# EAGLE design input_switch2 (EAGLE 6.5.0)
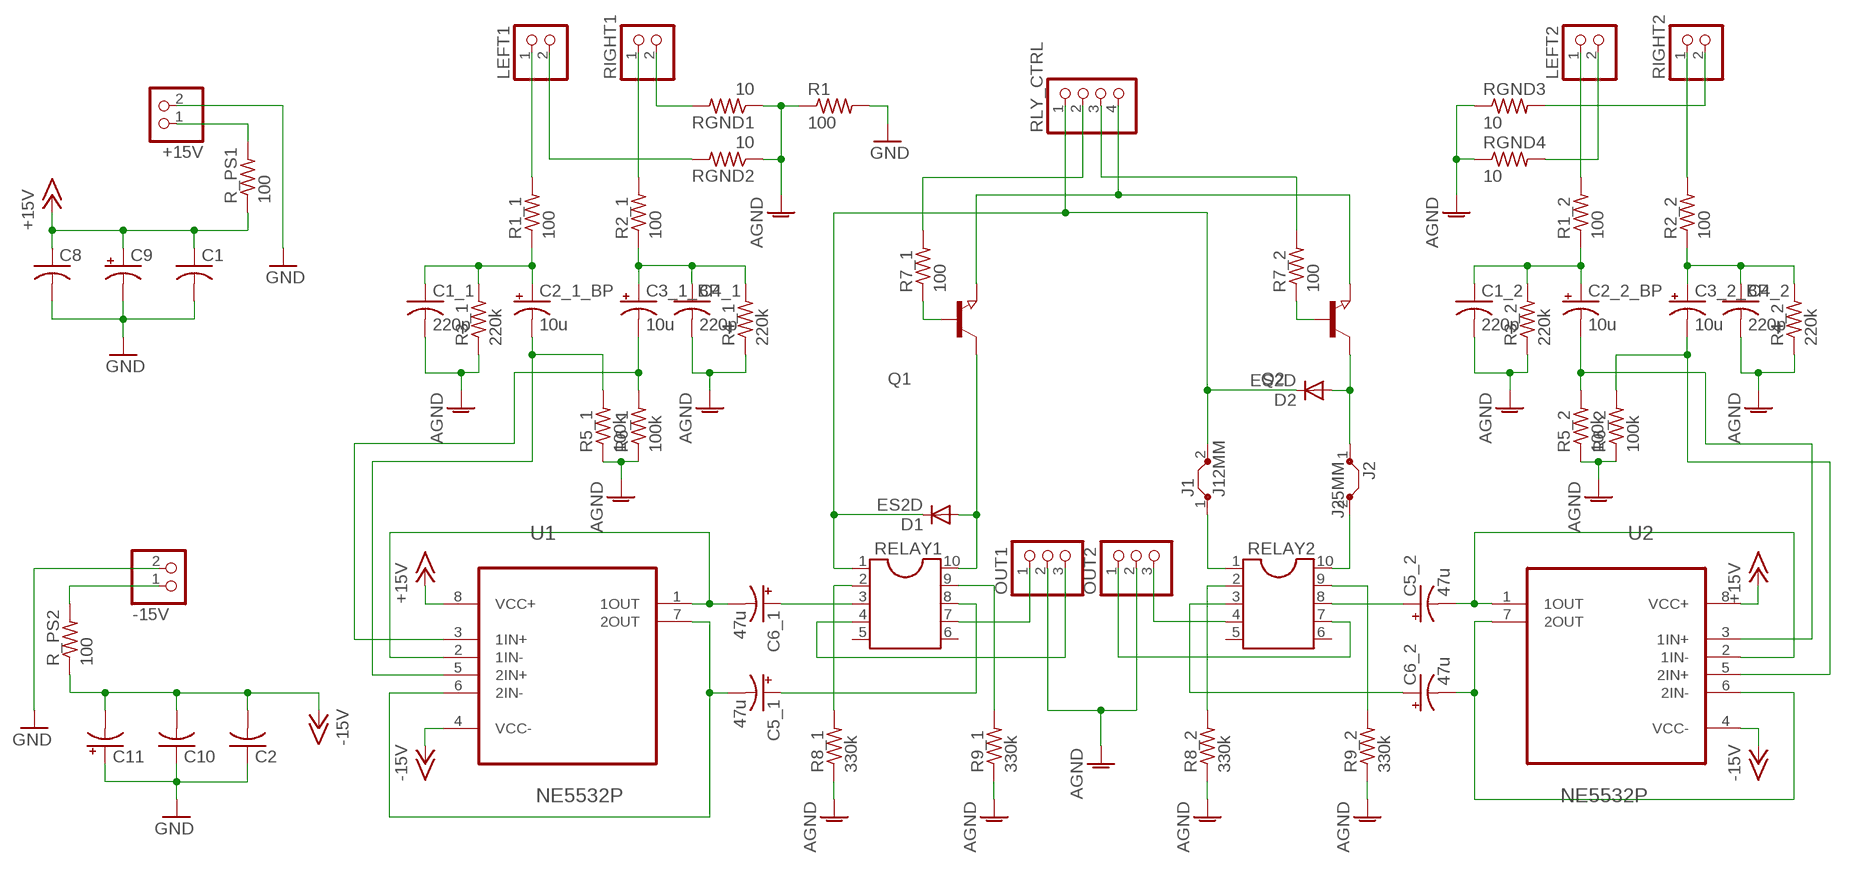
[diagram p0: schematic, sheet 1]

## Parts
+15V  PINHD-1X2  [1X02]
-15V  PINHD-1X2  [1X02]
C1  C-USC1206  [C1206]
C1_1  220p  C-US025-024X044  [C025-024X044]
C1_2  220p  C-US025-024X044  [C025-024X044]
C2  C-USC1206  [C1206]
C2_1_BP  10u  CPOL-USE2.5-7  [E2,5-7]
C2_2_BP  10u  CPOL-USE2.5-7  [E2,5-7]
C3_1_BP  10u  CPOL-USE2.5-7  [E2,5-7]
C3_2_BP  10u  CPOL-USE2.5-7  [E2,5-7]
C4_1  220p  C-US025-024X044  [C025-024X044]
C4_2  220p  C-US025-024X044  [C025-024X044]
C5_1  47u  CPOL-USE2-5  [E2-5]
C5_2  47u  CPOL-USE2-5  [E2-5]
C6_1  47u  CPOL-USE2-5  [E2-5]
C6_2  47u  CPOL-USE2-5  [E2-5]
C8  C-USC1206  [C1206]
C9  CPOL-USE2-5  [E2-5]
C10  C-USC1206  [C1206]
C11  CPOL-USE2-5  [E2-5]
D1  ES2D  [SMB]
D2  ES2D  [SMB]
J1  J12MM  [12]
J2  J25MM  [25]
LEFT1  PINHD-1X2  [1X02]
LEFT2  PINHD-1X2  [1X02]
OUT1  PINHD-1X3  [1X03]
OUT2  PINHD-1X3  [1X03]
Q1  NPN-TRANSISTOR_SOT23  [SOT23]
Q2  NPN-TRANSISTOR_SOT23  [SOT23]
R1  100  R-US_R1206  [R1206]
R1_1  100  R-US_0207/7  [0207/7]
R1_2  100  R-US_0207/7  [0207/7]
R2_1  100  R-US_0207/7  [0207/7]
R2_2  100  R-US_0207/7  [0207/7]
R3_1  220k  R-US_0207/7  [0207/7]
R3_2  220k  R-US_0207/7  [0207/7]
R4_1  220k  R-US_0207/7  [0207/7]
R4_2  220k  R-US_0207/7  [0207/7]
R5_1  100k  R-US_0207/7  [0207/7]
R5_2  100k  R-US_0207/7  [0207/7]
R6_1  100k  R-US_0207/7  [0207/7]
R6_2  100k  R-US_0207/7  [0207/7]
R7_1  100  R-US_R1206  [R1206]
R7_2  100  R-US_R1206  [R1206]
R8_1  330k  R-US_R1206  [R1206]
R8_2  330k  R-US_R1206  [R1206]
R9_1  330k  R-US_R1206  [R1206]
R9_2  330k  R-US_R1206  [R1206]
R_PS1  100  R-US_0207/7  [0207/7]
R_PS2  100  R-US_0207/7  [0207/7]
RELAY1  DIL10  [DIL10]
RELAY2  DIL10  [DIL10]
RGND1  10  R-US_R1206  [R1206]
RGND2  10  R-US_R1206  [R1206]
RGND3  10  R-US_R1206  [R1206]
RGND4  10  R-US_R1206  [R1206]
RIGHT1  PINHD-1X2  [1X02]
RIGHT2  PINHD-1X2  [1X02]
RLY_CTRL  PINHD-1X4  [1X04]
U1  NE5532P  [DIP254P762X508-8]
U2  NE5532P  [DIP254P762X508-8]

## Nets
+15V: C1.1 C8.1 C9.+ R_PS1.1 U1.8(VCC+) U2.8(VCC+)
-15V: C2.2 C10.2 C11.- R_PS2.1 U1.4(VCC-) U2.4(VCC-)
AGND: C1_1.2 C1_2.2 C4_1.2 C4_2.2 OUT1.2 OUT2.2 R1.1 R3_1.1 R3_2.1 R4_1.1 R4_2.1 R5_1.1 R5_2.1 R6_1.1 R6_2.1 R8_1.1 R8_2.1 R9_1.1 R9_2.1 RGND1.1 RGND2.1 RGND3.1 RGND4.1
GND: +15V.2 -15V.2 C1.2 C2.1 C8.2 C9.- C10.1 C11.+ R1.2
N$1: R2_1.2 RIGHT1.1
N$2: LEFT1.1 R1_1.2
N$3: C1_1.1 C2_1_BP.+ R1_1.1 R3_1.2
N$4: C2_1_BP.- R5_1.2 U1.5(2IN+)
N$5: C5_1.- U1.6(2IN-) U1.7(2OUT)
N$6: C3_1_BP.+ C4_1.1 R2_1.1 R4_1.2
N$7: C6_1.- U1.1(1OUT) U1.2(1IN-)
N$8: C6_1.+ RELAY1.3
N$9: OUT1.3 RELAY1.4
N$10: C6_2.- U2.6(2IN-) U2.7(2OUT)
N$11: R8_1.2 RELAY1.2
N$12: R9_1.2 RELAY1.9
N$13: C5_2.- U2.1(1OUT) U2.2(1IN-)
N$14: OUT1.1 RELAY1.7
N$15: R7_1.2 RLY_CTRL.2
N$16: Q1.1(B) R7_1.1
N$17: -15V.1 R_PS2.2
N$18: D1.A Q1.3(C) RELAY1.10
N$19: OUT2.1 RELAY2.7
N$20: C3_1_BP.- R6_1.2 U1.3(1IN+)
N$21: R2_2.2 RIGHT2.1
N$22: LEFT2.1 R1_2.2
N$23: C1_2.1 C2_2_BP.+ R1_2.1 R3_2.2
N$24: C3_2_BP.+ C4_2.1 R2_2.1 R4_2.2
N$25: +15V.1 R_PS1.2
N$26: C3_2_BP.- R6_2.2 U2.5(2IN+)
N$27: C2_2_BP.- R5_2.2 U2.3(1IN+)
N$28: OUT2.3 RELAY2.4
N$29: C6_2.+ RELAY2.3
N$30: C5_2.+ RELAY2.8
N$31: C5_1.+ RELAY1.8
N$32: R7_2.2 RLY_CTRL.3
N$33: LEFT1.2 RGND2.2
N$34: R8_2.2 RELAY2.2
N$35: R9_2.2 RELAY2.9
N$36: RGND1.2 RIGHT1.2
N$37: D1.C D2.C J1.2 RELAY1.1 RLY_CTRL.1
N$38: D2.A J2.1 Q2.3(C)
N$39: Q2.1(B) R7_2.1
N$40: Q1.2(E) Q2.2(E) RLY_CTRL.4
N$41: J1.1 RELAY2.1
N$42: RGND3.2 RIGHT2.2
N$43: LEFT2.2 RGND4.2
N$44: J2.2 RELAY2.10
Unconnected: RELAY1.5 RELAY1.6 RELAY2.5 RELAY2.6

## Library data of the parts
+15V -15V LEFT1 LEFT2 RIGHT1 RIGHT2 = pinhead:PINHD-1X2: PIN HEADER
C1 C1_1 C1_2 C2 C4_1 C4_2 C8 C10 = rcl:C-US: CAPACITOR, American symbol
C2_1_BP C2_2_BP C3_1_BP C3_2_BP C5_1 C5_2 C6_1 C6_2 C9 C11 = rcl:CPOL-US: POLARIZED CAPACITOR, American symbol
D1 D2 = diode:ES2D: DIODE super fast rectifier, 2 A
J1 J2 = jumper:J: Bridge
OUT1 OUT2 = pinhead:PINHD-1X3: PIN HEADER
Q1 Q2 = semicon-smd-ipc:NPN-TRANSISTOR_: NPN TRANSISTOR
R1 R1_1 R1_2 R2_1 R2_2 R3_1 R3_2 R4_1 R4_2 R5_1 R5_2 R6_1 R6_2 R7_1 R7_2 R8_1 R8_2 R9_1 R9_2 R_PS1 R_PS2 RGND1-RGND4 = rcl:R-US_: RESISTOR, American symbol
RELAY1 RELAY2 = ic-package:DIL10: Dual In Line / Socket
RLY_CTRL = pinhead:PINHD-1X4: PIN HEADER
U1 U2 = ne5532:NE5532P: OPERATIONAL AMPLIFIERS; MPN: NE5532P; OC_FARNELL: 1106092; OC_NEWARK: 59K8751; PACKAGE: PDIP; SUPPLIER: Texas Instruments

## Board
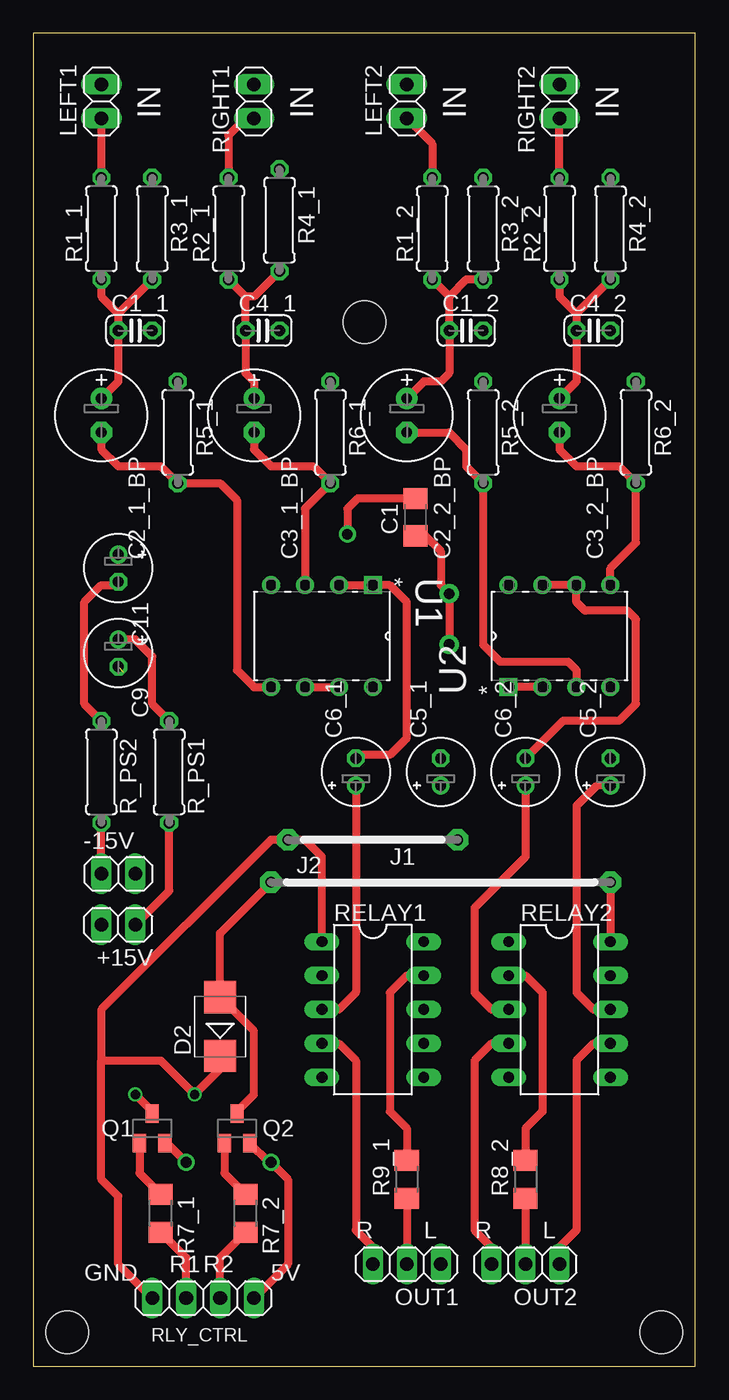
[diagram p1: board, top side]
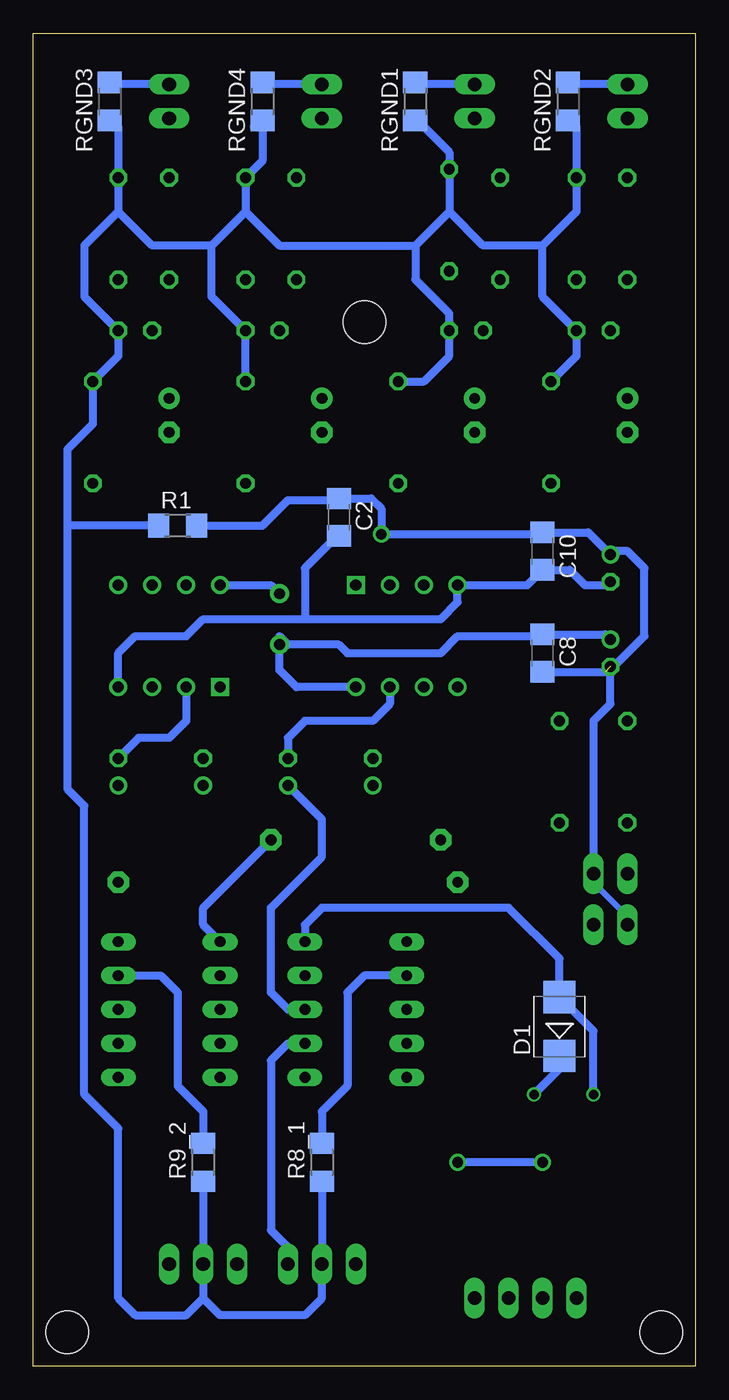
[diagram p2: board, bottom side, seen from below]

Size 49.53 x 99.69 mm. Coordinates in mm from the lower left corner, seen from the top.
Outline: 0,0 49.53,0 49.53,99.69 0,99.69 0,0
Copper layers (1*16): Top 0.035mm / dielectric 1.5mm / Bottom 0.035mm
Design rules "SeeedStudio_2layer_DRU_no_angle_20140221": minimum track width 6mil, minimum drill 12mil, track to track 6mil, track to pad 6mil, pad to pad 6mil, via to via 6mil, smd to smd 0mil, copper to edge 10mil, drill to drill 10mil, minimum pad ring 10mil, minimum via ring 6mil, stop-mask expansion 2mil, vias tented up to drill 100mil, thermal gap 10mil
Holes 3.2 mm at 46.99,2.54 2.54,2.54 24.77,78.11

### Footprints (pad centres in the part's own frame; a part is rotated, then mirrored left to right if it is on the bottom)
1X02 = drill 1.016 long: 1 -1.27,0; 2 1.27,0
C1206 = smd 1.6 x 1.8: 1 -1.4,0; 2 1.4,0
C025-024X044 = drill 0.813 octagon: 1 -1.27,0; 2 1.27,0
E2,5-7 = drill 0.813 pad 1.6: + -1.27,0 | drill 0.813 pad 1.6 octagon: - 1.27,0
E2-5 = drill 0.813 pad 1.27: + -1.016,0 | drill 0.813 pad 1.27 octagon: - 1.016,0
SMB = smd 2.4 x 2.4: A 2.2,0; C -2.2,0
12 = drill 0.813 pad 1.6 octagon: 1 -6.35,0; 2 6.35,0
25 = drill 0.813 pad 1.6 octagon: 1 -12.7,0; 2 12.7,0
1X03 = drill 1.016 long: 1 -2.54,0; 2 0,0; 3 2.54,0
SOT23 = smd 1 x 1.4: 1 -0.95,-1.1; 2 0.95,-1.1; 3 0,1.1
R1206 = smd 1.6 x 1.803: 1 -1.422,0; 2 1.422,0
0207/7 = drill 0.813 octagon: 1 -3.81,0; 2 3.81,0
DIL10 = drill 0.813 long: 1 -5.08,-3.81; 2 -2.54,-3.81; 3 0,-3.81; 4 2.54,-3.81; 5 5.08,-3.81; 6 5.08,3.81; 7 2.54,3.81; 8 0,3.81; 9 -2.54,3.81; 10 -5.08,3.81
1X04 = drill 1.016 long: 1 -3.81,0; 2 -1.27,0; 3 1.27,0; 4 3.81,0
DIP254P762X508-8 = drill 0.838 square: 1 -7.62,7.62 | drill 0.838: 2 -7.62,5.08; 3 -7.62,2.54; 4 -7.62,0; 5 0,0; 6 0,2.54; 7 0,5.08; 8 0,7.62

### Placement (x,y rotation side)
+15V  6.35,33.02 180 top
-15V  6.35,36.83 0 top
C1  28.57,63.5 90 top
C1_1  7.62,77.47 0 top
C1_2  32.38,77.47 0 top
C2  26.67,63.5 270 bottom
C2_1_BP  5.08,71.12 270 top
C2_2_BP  27.94,71.12 270 top
C3_1_BP  16.51,71.12 270 top
C3_2_BP  39.37,71.12 270 top
C4_1  17.14,77.47 0 top
C4_2  41.91,77.47 0 top
C5_1  30.48,44.45 90 top
C5_2  43.18,44.45 90 top
C6_1  24.13,44.45 90 top
C6_2  36.83,44.45 90 top
C8  11.43,53.34 270 bottom
C9  6.35,53.34 270 top
C10  11.43,60.96 270 bottom
C11  6.35,59.69 270 top
D1  10.16,25.4 90 bottom
D2  13.97,25.4 90 top
J1  25.4,39.37 180 top
J2  30.48,36.2 0 top
LEFT1  5.08,94.61 90 top
LEFT2  27.94,94.61 90 top
OUT1  27.94,7.62 180 top
OUT2  36.83,7.62 180 top
Q1  8.89,17.78 0 top
Q2  15.24,17.78 0 top
R1  38.73,62.87 0 bottom
R1_1  5.08,85.09 90 top
R1_2  29.84,85.09 90 top
R2_1  14.61,85.09 90 top
R2_2  39.37,85.09 90 top
R3_1  8.89,85.09 270 top
R3_2  33.66,85.09 270 top
R4_1  18.41,85.72 270 top
R4_2  43.18,85.09 270 top
R5_1  10.79,69.85 270 top
R5_2  33.66,69.85 270 top
R6_1  22.23,69.85 270 top
R6_2  45.09,69.85 270 top
R7_1  9.53,11.43 270 top
R7_2  15.88,11.43 270 top
R8_1  27.94,15.24 90 bottom
R8_2  36.83,13.97 90 top
R9_1  27.94,13.97 90 top
R9_2  36.83,15.24 90 bottom
R_PS1  10.16,44.45 270 top
R_PS2  5.08,44.45 270 top
RELAY1  25.4,26.67 270 top
RELAY2  39.37,26.67 270 top
RGND1  20.95,94.61 90 bottom
RGND2  9.53,94.61 90 bottom
RGND3  43.81,94.61 90 bottom
RGND4  32.38,94.61 90 bottom
RIGHT1  16.51,94.61 90 top
RIGHT2  39.37,94.61 90 top
RLY_CTRL  12.7,5.08 0 top
U1  17.78,50.8 270 top
U2  43.18,58.42 90 top

### Tracks (layer width: path | path; a pad name or v marks a point on that pad's centre or on a via)
+15V  (via drill 0.8 pad 1.42)
  Top 0.61: v31.11,53.98 v31.11,57.78 30.48,58.42 30.48,60.96 29.34,62.1 C1.1 | R_PS1.1 8.89,49.53 8.89,53.09 7.62,54.36 C9.+
  Bottom 0.61: U2.8 31.75,58.42 v31.11,57.78 | C9.+ 6.73,54.74 C8.1 11.56,54.61 17.78,54.61 19.05,53.34 26.04,53.34 26.67,53.98 30.48,53.98 31.11,54.61 v31.11,53.98 31.11,53.34 31.11,52.07 29.84,50.8 U1.8
-15V
  Top 0.61: R_PS2.1 3.81,49.53 3.81,57.15 5.08,58.42 6.1,58.42 C11.-
  Bottom 0.61: U2.4 43.18,53.34 41.91,54.61 38.1,54.61 36.83,55.88 29.21,55.88 | 29.21,55.88 19.05,55.88 17.78,57.15 U1.4 12.57,58.42 C10.2 9.39,59.56 8.26,58.42 6.6,58.42 C11.- | C2.2 26.8,62.1 29.21,59.69 29.21,55.88
AGND
  Top 0.61: R9_1.1 OUT1.2 | R8_2.1 OUT2.2
  Bottom 0.61: R5_1.1 8.89,75.56 C1_1.2 11.43,80.01 11.43,83.82 | OUT2.2 R9_2.1 36.83,5.08 | R8_1.1 OUT1.2 27.94,5.08 29.21,3.81 35.56,3.81 36.83,5.08 | 46.99,62.87 46.99,68.58 45.09,70.48 R6_2.1 43.18,75.56 C4_2.2 45.72,80.01 45.72,83.82 43.18,86.36 | 46.99,62.87 46.99,43.18 45.72,41.91 45.72,20.32 43.18,17.78 43.18,5.08 41.91,3.81 38.1,3.81 36.83,5.08 | R1.1 46.99,62.87 | 43.18,86.36 R4_2.1 43.18,92.71 43.66,93.19 RGND3.1 | RGND1.1 20.8,93.19 18.41,90.81 R4_1.1 18.41,86.36 | 33.02,92.71 32.54,93.19 RGND4.1 32.38,90.17 R3_2.1 33.66,86.36 | R6_1.1 20.32,73.66 18.41,75.56 C4_1.2 18.41,78.74 20.95,81.28 20.95,83.82 | RGND2.1 9.37,93.19 8.89,92.71 R3_1.1 8.89,86.36 11.43,83.82 | 18.41,86.36 20.95,83.82 | 11.43,83.82 15.88,83.82 18.41,86.36 | 36.2,83.82 40.64,83.82 43.18,86.36 | R5_2.1 C1_2.2 36.2,80.01 36.2,83.82 | 36.2,83.82 33.66,86.36 | 33.66,86.36 31.11,83.82 20.95,83.82
GND  (via drill 0.8 pad 1.27)  (1 unrouted)
  Top 0.61: C1.2 24.26,64.9 23.5,64.14 v23.5,62.23
  Bottom 0.406: 7.62,36.2 5.08,33.66
  Bottom 0.61: C8.2 6.73,51.94 | 7.62,36.2 -15V.2 7.62,48.26 6.35,49.53 C9.- 6.1,52.32 3.81,54.61 3.81,59.69 5.08,60.96 6.1,60.96 C11.+ 8,62.36 C10.1 11.56,62.23 v23.5,62.23 23.5,64.14 24.26,64.9 C2.1 26.8,64.77 30.48,64.77 32.38,62.87 R1.2 | 5.08,33.66 +15V.2
N$1
  Top 0.61: RIGHT1.1 15.88,93.34 14.61,92.08 R2_1.2
N$2
  Top 0.61: LEFT1.1 R1_1.2
N$3
  Top 0.61: R1_1.1 5.08,80.01 6.35,78.74 | 6.35,78.74 C1_1.1 6.35,73.66 C2_1_BP.+ | R3_1.2 6.35,78.74
N$4
  Top 0.61: C2_1_BP.- 5.08,68.58 6.35,67.31 9.53,67.31 R5_1.2 13.97,66.04 15.24,64.77 15.24,52.07 16.51,50.8 U1.5
N$5
  Top 0.61: U1.6 U1.7
  Bottom 0.61: U1.7 22.86,49.53 24.13,48.26 29.21,48.26 30.48,46.99 C5_1.-
N$6
  Top 0.61: C3_1_BP.+ 16.51,73.66 15.88,74.3 C4_1.1 15.88,80.01 | 15.88,80.01 R2_1.1 | R4_1.2 16.51,80.01 15.88,80.01
N$7
  Top 0.61: U1.2 U1.1 26.67,58.42 27.94,57.15 27.94,46.99 26.67,45.72 24.38,45.72 C6_1.-
N$8
  Top 0.61: C6_1.+ 24.13,27.94 22.86,26.67 RELAY1.3
N$9
  Top 0.61: RELAY1.4 22.86,24.13 24.13,22.86 24.13,10.16 25.4,8.89 OUT1.3
N$10
  Top 0.61: U2.7 U2.6 40.64,57.15 41.27,56.52 44.45,56.52 45.09,55.88 45.09,49.53 43.81,48.26 39.62,48.26 C6_2.-
N$11
  Bottom 0.61: RELAY1.2 24.77,29.21 26.04,27.94 26.04,20.95 27.94,19.05 R8_1.2
N$12
  Top 0.61: RELAY1.9 27.94,29.21 26.67,27.94 26.67,19.05 27.94,17.78 R9_1.2
N$13
  Top 0.61: U2.2 U2.1
  Bottom 0.61: U2.2 38.1,48.26 39.37,46.99 41.66,46.99 C5_2.-
N$14
  Bottom 0.61: RELAY1.7 30.48,24.13 31.75,22.86 31.75,10.16 30.48,8.89 OUT1.1
N$15
  Top 0.61: RLY_CTRL.2 11.43,8.1 R7_1.2
N$16
  Top 0.61: Q1.1 7.94,14.44 R7_1.1
N$17
  Top 0.61: -15V.1 R_PS2.2
N$18  (via drill 0.7 pad 1.02)
  Top 0.61: Q1.3 8.89,19.05 v7.62,20.32
  Bottom 0.61: v7.62,20.32 7.62,25.06 D1.A | 11.09,27.94 D1.A | D1.A 10.16,30.48 13.97,34.29 27.94,34.29 29.21,33.02 RELAY1.10
N$19
  Top 0.61: RELAY2.7 41.91,24.13 40.64,22.86 40.64,10.16 39.37,8.89 OUT2.1
N$20
  Top 0.61: C3_1_BP.- 16.51,68.58 17.78,67.31 20.95,67.31 R6_1.2 20.32,64.14 U1.3
N$21
  Top 0.61: R2_2.2 RIGHT2.1
N$22
  Top 0.61: LEFT2.1 29.84,91.44 R1_2.2
N$23
  Top 0.61: C2_2_BP.+ 29.21,73.66 30.48,73.66 31.11,74.3 C1_2.1 31.11,80.01 | 31.11,80.01 R1_2.1 | R3_2.2 32.38,81.28 31.11,80.01
N$24
  Top 0.61: R2_2.1 39.37,80.01 40.64,78.74 | 40.64,78.74 C4_2.1 40.64,73.66 C3_2_BP.+ | R4_2.2 40.64,78.74
N$25
  Top 0.61: +15V.1 10.16,35.56 R_PS1.2
N$26
  Top 0.61: C3_2_BP.- 39.37,68.58 40.64,67.31 43.81,67.31 R6_2.2 45.09,61.59 43.18,59.69 U2.5
N$27
  Top 0.61: U2.3 40.64,52.07 40.01,52.7 34.92,52.7 33.66,53.98 R5_2.2 32.38,67.31 32.38,68.58 31.11,69.85 C2_2_BP.-
N$28
  Top 0.61: RELAY2.4 34.29,24.13 33.02,22.86 33.02,10.16 34.29,8.89 OUT2.3
N$29
  Top 0.61: RELAY2.3 34.29,26.67 33.02,27.94 33.02,34.29 36.83,38.1 C6_2.+
N$30
  Top 0.61: C5_2.+ 42.16,43.43 40.64,41.91 40.64,27.94 41.91,26.67 RELAY2.8
N$31
  Bottom 0.61: RELAY1.8 30.48,26.67 31.75,27.94 31.75,34.29 27.94,38.1 27.94,40.89 C5_1.+
N$32
  Top 0.61: RLY_CTRL.3 13.97,8.1 R7_2.2
N$33
  Bottom 0.406: 9.37,95.89 RGND2.2
  Bottom 0.61: LEFT1.2 9.37,95.89
N$34
  Top 0.61: RELAY2.2 36.83,29.21 38.1,27.94 38.1,19.05 36.83,17.78 R8_2.2
N$35
  Bottom 0.61: RELAY2.9 40.01,29.21 38.73,27.94 38.73,20.95 36.83,19.05 R9_2.2
N$36
  Bottom 0.61: RIGHT1.2 20.8,95.89 RGND1.2
N$37  (via drill 0.7 pad 1.02)
  Top 0.61: RLY_CTRL.1 6.35,7.62 6.35,12.7 5.08,13.97 5.08,22.86 | D2.C 13.97,22.23 v12.06,20.32 9.53,22.86 5.08,22.86 | 5.08,22.86 5.08,26.67 17.78,39.37 J1.2 20.32,39.37 21.59,38.1 RELAY1.1
  Bottom 0.61: D1.C 10.16,22.23 v12.06,20.32
N$38
  Top 0.61: Q2.3 15.24,19.05 16.51,20.32 16.51,25.06 D2.A 13.97,32.38 J2.1
N$39
  Top 0.61: 15.56,13.17 R7_2.1 14.29,14.44 Q2.1
N$40  (via drill 0.8 pad 1.27)
  Top 0.61: RLY_CTRL.4 19.05,7.62 19.05,13.97 v17.78,15.24 17.63,15.24 Q2.2 | Q1.2 9.99,16.68 v11.43,15.24
  Bottom 0.61: v11.43,15.24 v17.78,15.24
N$41
  Bottom 0.61: RELAY2.1 36.83,33.02 36.83,34.29 J1.1
N$42
  Bottom 0.61: RIGHT2.2 43.66,95.89 RGND3.2
N$43
  Bottom 0.61: LEFT2.2 32.23,95.89 RGND4.2
N$44
  Top 0.61: J2.2 RELAY2.10

### Text on the board
tPlace: IN | IN | IN | IN | R | L | R | L | R1 | R2 | GND | 5V